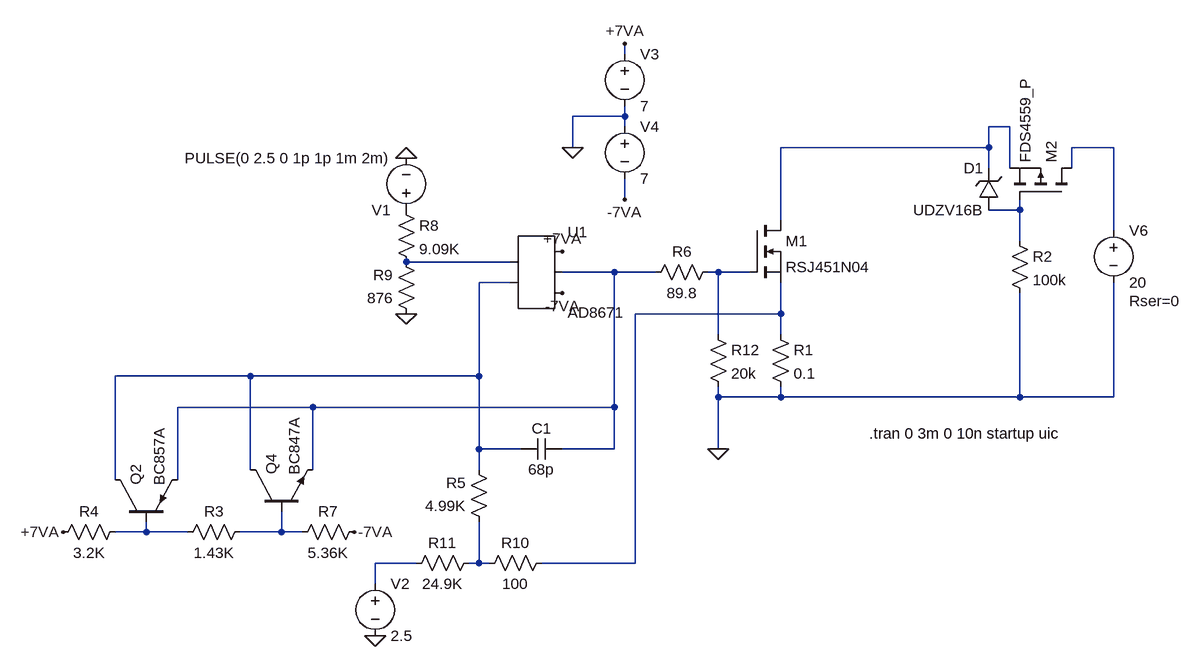
[diagram p0: schematic SIM_WITH_LOAD_NO_ADC_INP.asc]
SIM_WITH_LOAD_NO_ADC_INP.asc, the LTspice schematic file:
Version 4
SHEET 1 1792 1060
WIRE -272 -128 -272 -144
WIRE -272 -32 -272 -48
WIRE -272 -32 -352 -32
WIRE -272 -16 -272 -32
WIRE 320 -16 288 -16
WIRE -352 16 -352 -32
WIRE 288 16 288 -16
WIRE 288 16 -32 16
WIRE 480 16 416 16
WIRE 288 48 288 16
WIRE 320 48 320 -16
WIRE 416 48 416 16
WIRE -272 96 -272 64
WIRE 336 112 336 96
WIRE 336 112 288 112
WIRE -32 128 -32 16
WIRE 480 144 480 16
WIRE 336 160 336 112
WIRE -448 192 -608 192
WIRE -288 208 -368 208
WIRE -224 208 -288 208
WIRE -128 208 -144 208
WIRE -80 208 -128 208
WIRE -448 224 -496 224
WIRE -32 272 -32 224
WIRE -32 272 -256 272
WIRE -128 304 -128 208
WIRE -32 304 -32 272
WIRE -848 368 -1056 368
WIRE -496 368 -496 224
WIRE -496 368 -848 368
WIRE -128 400 -128 384
WIRE -32 400 -32 384
WIRE -32 400 -128 400
WIRE 336 400 336 240
WIRE 336 400 -32 400
WIRE 480 400 480 224
WIRE 480 400 336 400
WIRE -752 416 -960 416
WIRE -288 416 -288 208
WIRE -288 416 -752 416
WIRE -496 480 -496 368
WIRE -432 480 -496 480
WIRE -288 480 -288 416
WIRE -288 480 -368 480
WIRE -128 480 -128 400
WIRE -848 512 -848 368
WIRE -752 512 -752 416
WIRE -496 512 -496 480
WIRE -1056 528 -1056 368
WIRE -960 528 -960 416
WIRE -1008 608 -1008 592
WIRE -1008 608 -1056 608
WIRE -944 608 -1008 608
WIRE -800 608 -800 576
WIRE -800 608 -864 608
WIRE -768 608 -800 608
WIRE -592 656 -656 656
WIRE -496 656 -496 592
WIRE -496 656 -512 656
WIRE -480 656 -496 656
WIRE -256 656 -256 272
WIRE -256 656 -400 656
WIRE -656 688 -656 656
FLAG -352 16 0
FLAG -608 32 0
FLAG -656 768 0
FLAG -608 272 0
FLAG -272 -144 +7VA
FLAG -272 96 -7VA
FLAG -368 176 +7VA
FLAG -368 240 -7VA
FLAG -128 480 0
FLAG -688 608 -7VA
FLAG -1136 608 +7VA
SYMBOL nmos -80 128 R0
SYMATTR InstName M1
SYMATTR Value RSJ451N04
SYMBOL res -48 288 R0
SYMATTR InstName R1
SYMATTR Value 0.1
SYMBOL voltage -272 -144 R0
WINDOW 123 0 0 Left 2
WINDOW 39 0 0 Left 2
SYMATTR InstName V3
SYMATTR Value 7
SYMBOL voltage -272 -32 R0
WINDOW 123 0 0 Left 2
WINDOW 39 0 0 Left 2
SYMATTR InstName V4
SYMATTR Value 7
SYMBOL zener 304 112 R180
WINDOW 0 24 64 Left 2
WINDOW 3 24 0 Left 2
SYMATTR InstName D1
SYMATTR Value UDZV16B
SYMATTR Description Diode
SYMATTR Type diode
SYMBOL res 320 144 R0
SYMATTR InstName R2
SYMATTR Value 100k
SYMBOL pmos 416 96 M270
SYMATTR InstName M2
SYMATTR Value FDS4559_P
SYMBOL voltage 480 128 R0
WINDOW 123 0 0 Left 2
WINDOW 39 24 124 Left 2
SYMATTR SpiceLine Rser=0
SYMATTR InstName V6
SYMATTR Value 20
SYMBOL res -128 192 R90
WINDOW 0 0 56 VBottom 2
WINDOW 3 32 56 VTop 2
SYMATTR InstName R6
SYMATTR Value 89.8
SYMBOL cap -368 464 R90
WINDOW 0 0 32 VBottom 2
WINDOW 3 32 32 VTop 2
SYMATTR InstName C1
SYMATTR Value 68p
SYMBOL voltage -608 128 R180
WINDOW 123 0 0 Left 2
WINDOW 39 0 0 Left 2
SYMATTR InstName V1
SYMATTR Value PULSE(0 2.5 0 1p 1p 1m 2m)
SYMBOL res -624 96 R0
SYMATTR InstName R8
SYMATTR Value 9.09K
SYMBOL res -592 288 R180
WINDOW 0 36 76 Left 2
WINDOW 3 36 40 Left 2
SYMATTR InstName R9
SYMATTR Value 876
SYMBOL voltage -656 672 R0
WINDOW 123 0 0 Left 2
WINDOW 39 0 0 Left 2
SYMATTR InstName V2
SYMATTR Value 2.5
SYMBOL res -384 640 R90
WINDOW 0 0 56 VBottom 2
WINDOW 3 32 56 VTop 2
SYMATTR InstName R10
SYMATTR Value 100
SYMBOL res -496 640 R90
WINDOW 0 0 56 VBottom 2
WINDOW 3 32 56 VTop 2
SYMATTR InstName R11
SYMATTR Value 24.9K
SYMBOL res -144 288 R0
SYMATTR InstName R12
SYMATTR Value 20k
SYMBOL AutoGenerated\\AD8671 -416 208 R0
SYMATTR InstName U1
SYMBOL res -480 608 R180
WINDOW 0 36 76 Left 2
WINDOW 3 36 40 Left 2
SYMATTR InstName R5
SYMATTR Value 4.99K
SYMBOL pnp -1056 592 R270
SYMATTR InstName Q2
SYMATTR Value BC857A
SYMBOL npn -848 576 R270
SYMATTR InstName Q4
SYMATTR Value BC847A
SYMBOL res -848 592 R90
WINDOW 0 0 56 VBottom 2
WINDOW 3 32 56 VTop 2
SYMATTR InstName R3
SYMATTR Value 1.43K
SYMBOL res -1040 592 R90
WINDOW 0 0 56 VBottom 2
WINDOW 3 32 56 VTop 2
SYMATTR InstName R4
SYMATTR Value 3.2K
SYMBOL res -672 592 R90
WINDOW 0 0 56 VBottom 2
WINDOW 3 32 56 VTop 2
SYMATTR InstName R7
SYMATTR Value 5.36K
TEXT 104 456 Left 2 !.tran 0 3m 0 10n startup uic

The netlist it stands for:
* SIM_WITH_LOAD_NO_ADC_INP.asc
M1 N001 N006 N008 N008 RSJ451N04
R1 N008 0 0.1
V3 +7VA 0 7
V4 0 -7VA 7
D1 N003 N001 UDZV16B
R2 N003 0 100k
M2 N002 N003 N001 N001 FDS4559_P
V6 N002 0 20 Rser=0
R6 N006 N005 89.8
C1 N005 N007 68p
V1 P001 0 PULSE(0 2.5 0 1p 1p 1m 2m)
R8 P001 N004 9.09K
R9 0 N004 876
V2 N011 0 2.5
R10 N008 N012 100
R11 N012 N011 24.9K
R12 N006 0 20k
* U1: AD8671 (symbol AutoGenerated\AD8671 not available, pins judged from their places): pin1=N004 pin2=N007 pin3=+7VA pin4=N005 pin5=-7VA
R5 N012 N007 4.99K
Q2 N007 N009 N005 0 BC857A
Q4 N007 N010 N005 0 BC847A
R3 N010 N009 1.43K
R4 N009 +7VA 3.2K
R7 -7VA N010 5.36K
.model D D
.lib standard.dio
.model NPN NPN
.model PNP PNP
.lib standard.bjt
.model NMOS NMOS
.model PMOS PMOS
.lib standard.mos
.tran 0 3m 0 10n startup uic
.backanno
.end